# Altium project WLED.PrjPcb
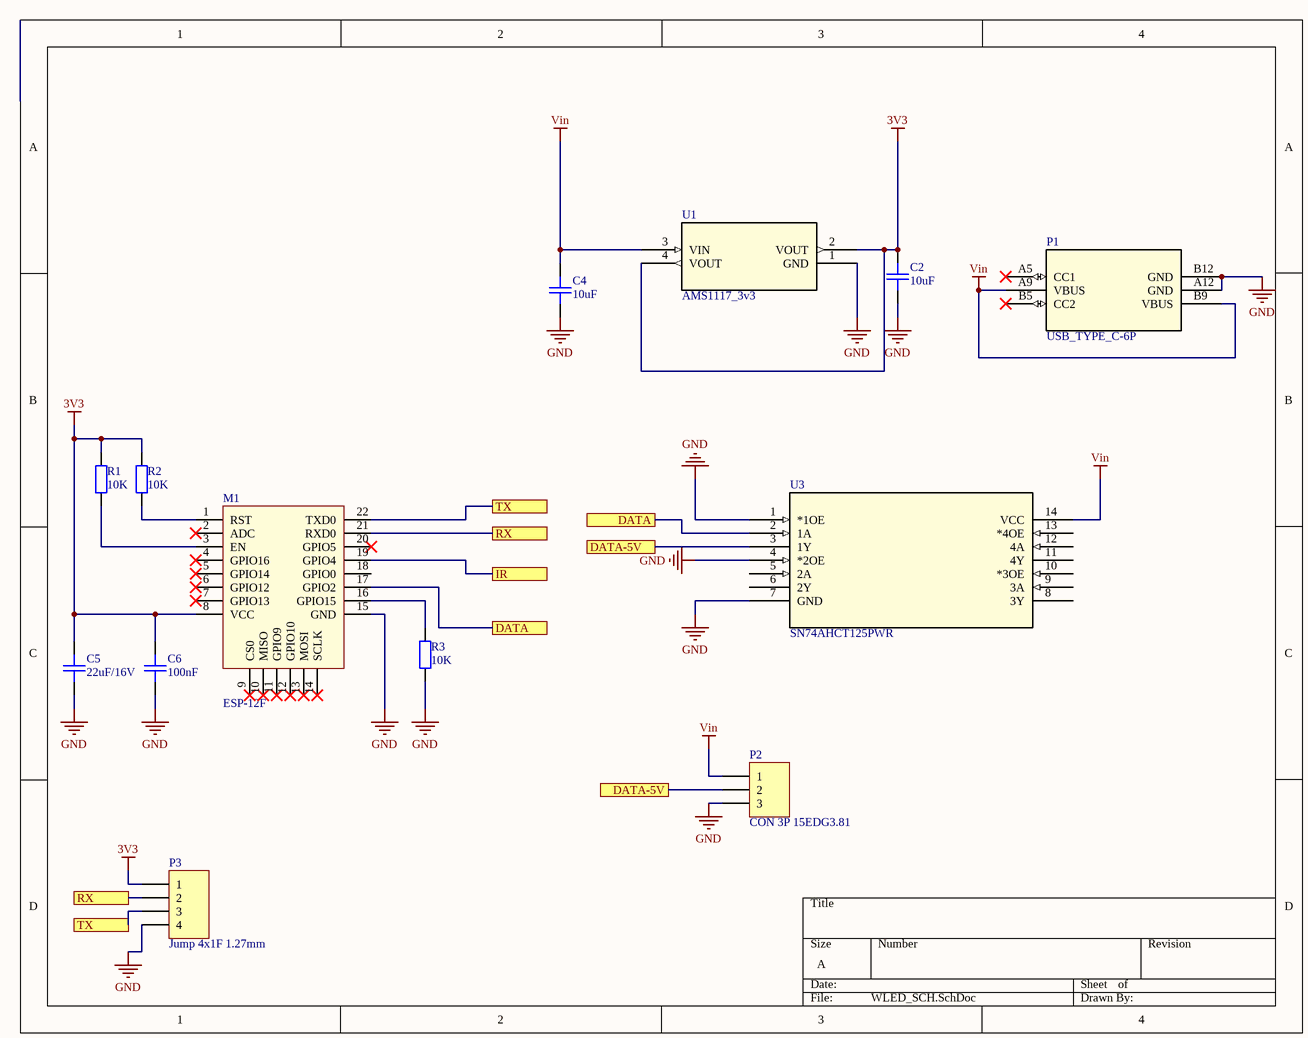
[diagram p0: WLED_SCH.SchDoc]
1 sheet, 13 parts. Net scope: flat (ports and power ports of the same name join across sheets).
Board files: WLED_PCB.PcbDoc, Dat_Mach_LED.PcbDoc

## Sheet WLED_SCH.SchDoc
size A; SheetNumber: 1; SheetTotal: 1

### Parts
C2  10uF  [CAPC-0603 (1608)]
C4  10uF  [CAPC-0603 (1608)]
C5  22uF/16V  [CAPC-0603 (1608)]
C6  100nF  [CAPC-0603 (1608)]
M1  ESP-12F  [ESP-12E&F Module]
P1  USB_TYPE_C-6P  [USB_TYPE_C_6P]
P2  CON 3P 15EDG3.81  [HDR_3.81MM_RA_3x1]
P3  Jump 4x1F 1.27mm  [JP4_1.27MM]
R1  10K  [RESC-0603 (1608)]
R2  10K  [RESC-0603 (1608)]
R3  10K  [RESC-0603 (1608)]
U1  AMS1117_3v3  [SOT-223-3L_UMW]
U3  SN74AHCT125PWR  [PW14-L]

### Ports
DATA, DATA-5V, IR, RX, TX

### Nets
3V3: C2.2 C5.2 C6.2 M1.8(VCC) P3.1 R1.2 R2.2 U1.2(VOUT) U1.4(VOUT)
GND: C2.1 C4.1 C5.1 C6.1 M1.15(GND) P1.A12(GND) P1.B12(GND) P2.3 P3.4 R3.1 U1.1(GND) U3.1(*1OE) U3.4(*2OE) U3.7(GND)
Vin: C4.2 P1.A9(VBUS) P1.B9(VBUS) P2.1 U1.3(VIN) U3.14(VCC)
NetM1_1: M1.1(RST) R2.1
NetM1_3: M1.3(EN) R1.1
NetM1_16: M1.16(GPIO15) R3.2
NetM1_17: M1.17(GPIO2) U3.2(1A) ; port DATA
NetM1_19: M1.19(GPIO4) ; port IR
NetM1_21: M1.21(RXD0) P3.2 ; port RX
NetM1_22: M1.22(TXD0) P3.3 ; port TX
NetP2_2: P2.2 U3.3(1Y) ; port DATA-5V

Not connected (* = marked no-connect by the designer): M1 2(ADC)* 4(GPIO16)* 5(GPIO14)* 6(GPIO12)* 7(GPIO13)* 9(CS0)* 10(MISO)* 11(GPIO9)* 12(GPIO10)* 13(MOSI)* 14(SCLK)* 18(GPIO0) 20(GPIO5)*; P1 A5(CC1)* B5(CC2)*; U3 5(2A) 6(2Y) 8(3Y) 9(3A) 10(*3OE) 11(4Y) 12(4A) 13(*4OE)

### Library data of the parts
C2 C4 C6 = CL10A226MO7JZNC: CAP CER 22UF 16V X5R 0603; Solder: SMT; Value: 22uF/16V; MPN: CL10A226MO7JZNC; Category: CAPACITOR; PinCount: 2
C5 = CL10A226MO7JZNC: CAP CER 22UF 16V X5R 0603; Solder: SMT; MPN: CL10A226MO7JZNC; Value: 22uF/16V; Category: CAPACITOR; PinCount: 2
M1 = ESP-12F: ESP-12F Module; MFR: Espressif; Solder: SMT; Category: MODULE; MPN: ESP-12F; PinCount: 22; Value: ESP-12F
P2 = CON 3P 15EDG3.81: Header 3, pitch 3.81mm, right angle
R1-R3 = RC0603FR-0710KL: RES SMD 10K OHM 1% 1/10W 0603; CompanyID: VT-00328; Solder: SMT; MPN: RC0603FR-0710KL; Value: 10K; Category: RESISTOR
U3 = SN74AHCT125PWR: No Description Available; Mfr_Name: Texas Instruments; Copyright: Copyright (C) 2023 Ultra Librarian. All rights reserved.; Manufacturer_Part_Number: SN74AHCT125PWR; RefDes: RefDes; Type: DEV